# EasyEDA schematic LcsNodes-Building-Block-Dual-Power-Module-L6204.json
TITLE: Dual Power Module - L6204; REV: 1.0; Date: 2022-09-19; Sheet: 1/1; Drawn By: helmut-f; Company: Your Company
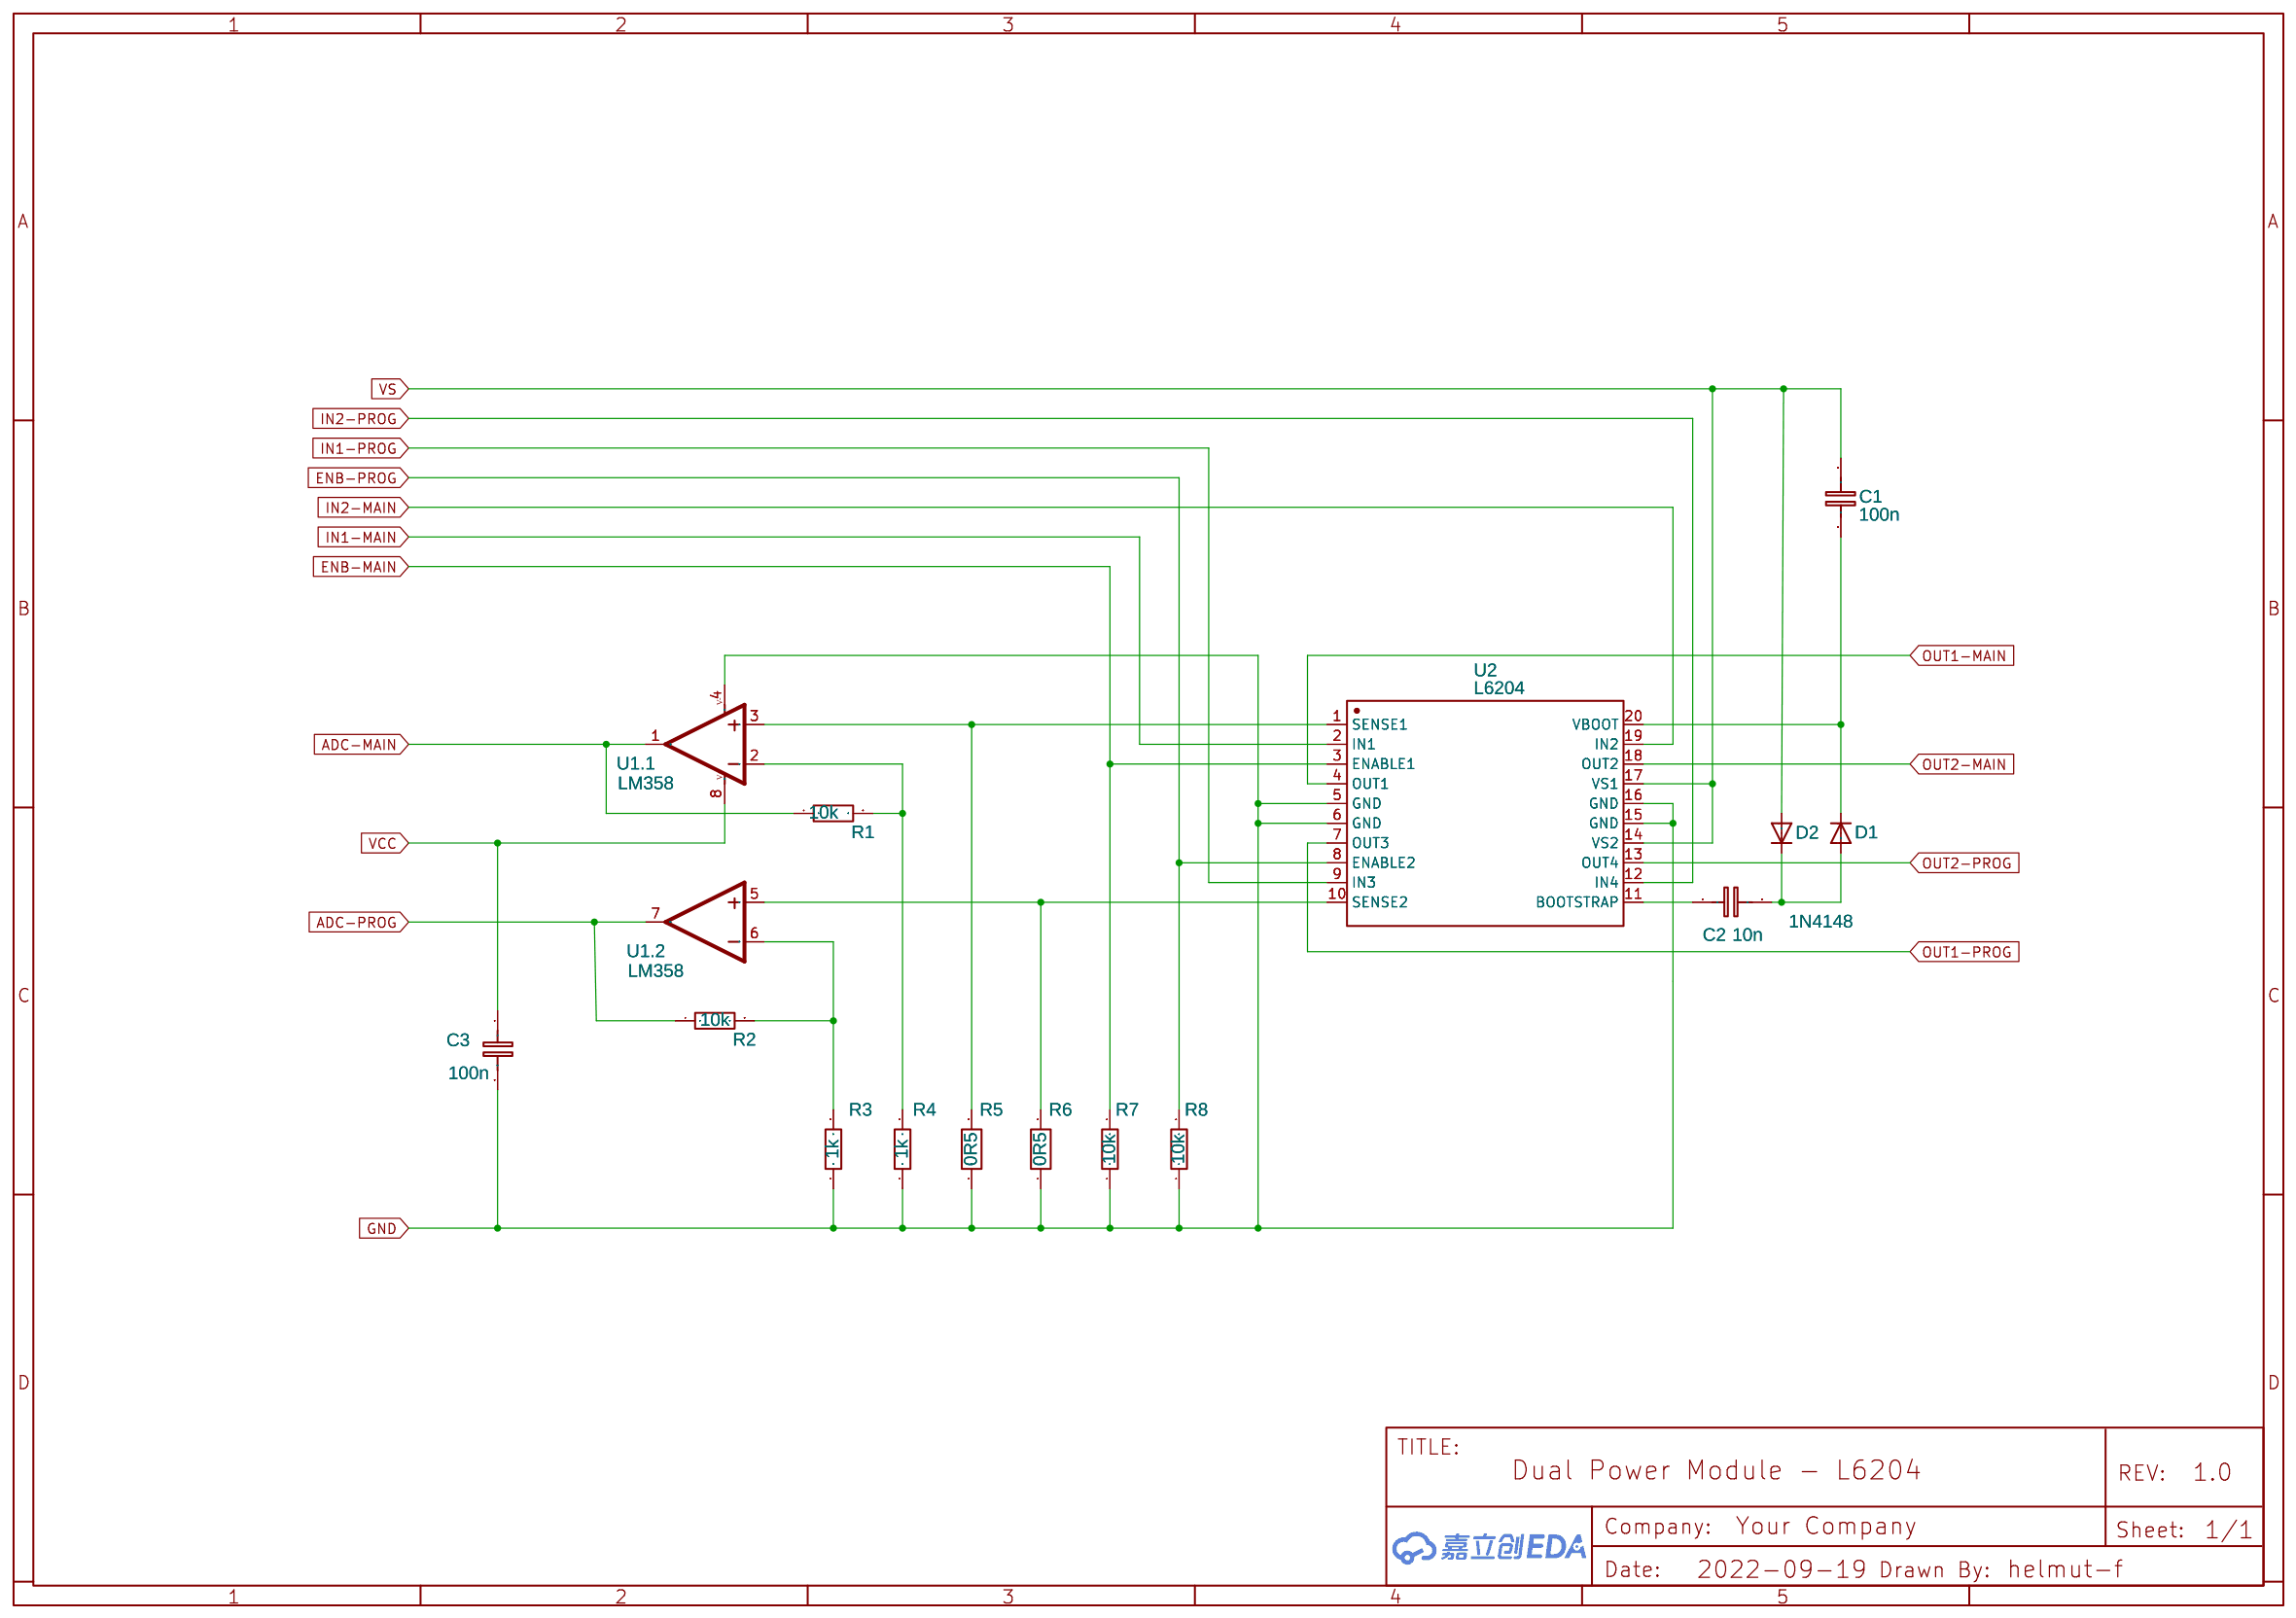
[diagram p0: schematic sheet]

## Parts
C1  100n  [RAD-0.2]
C2  10n  [RAD-0.2]
C3  100n  [RAD-0.2]
D1  1N4148DO35-10  [DO35-10]
D2  1N4148  [DO35-10]
R1  10k  [AXIAL-0.1]
R2  10k  [AXIAL-0.1]
R3  1k  [AXIAL-0.1]
R4  1k  [AXIAL-0.1]
R5  0R5  [R_AXIAL-0.5]
R6  0R5  [R_AXIAL-0.5]
R7  10k  [AXIAL-0.1]
R8  10k  [AXIAL-0.1]
U1  LM358  [DIP08-KIT]  (sections 1,2)
U2  L6204  [DIP20]

## Library data of the parts
C1 C3 = C_0603_EU: Contributor: LCEDA_Lib; Package Display: No
C2 = C_RAD-0.2_EU: Contributor: LCEDA_Lib
D1 D2 = 1N4148DO35-10: DIODE; Package Display: No
R1-R4 R7 R8 = RESISTOR-AXIAL-0.1
R5 R6 = R_AXIAL-0.5_EU: Contributor: LCEDA_Lib
U1 = LM358: Contributor: SparkFun; subpart_no: 1
U2 = L6204

## Nets
GND: C3.2 R3.1 R4.1 R5.1 R6.1 R7.1 R8.1 U1.4(V-) U2.5(GND) U2.6(GND) U2.15(GND) U2.16(GND)
VCC: C3.1 U1.8(V+)
ADC-MAIN: R1.1 U1.1(OUT)
ADC-PROG: R2.1 U1.7(OUT)
ENB-MAIN: R7.2 U2.3(ENABLE1)
ENB-PROG: R8.2 U2.8(ENABLE2)
IN1-MAIN: U2.2(IN1)
IN1-PROG: U2.9(IN3)
IN2-MAIN: U2.19(IN2)
IN2-PROG: U2.12(IN4)
OUT1-MAIN: U2.4(OUT1)
OUT1-PROG: U2.7(OUT3)
OUT2-MAIN: U2.18(OUT2)
OUT2-PROG: U2.13(OUT4)
VS: C1.2 D2.A U2.14(VS2) U2.17(VS1)
Net-(C1-1): C1.1 D1.C U2.20(VBOOT)
Net-(C2-1): C2.1 U2.11(BOOTSTRAP)
Net-(C2-2): C2.2 D1.A D2.C
Net-(R1-2): R1.2 R4.2 U1.2(-IN)
Net-(R2-2): R2.2 R3.2 U1.6(-IN)
Net-(R5-2): R5.2 U1.3(+IN) U2.1(SENSE1)
Net-(R6-2): R6.2 U1.5(+IN) U2.10(SENSE2)
